# EAGLE design 25k80 (EAGLE 6.2)
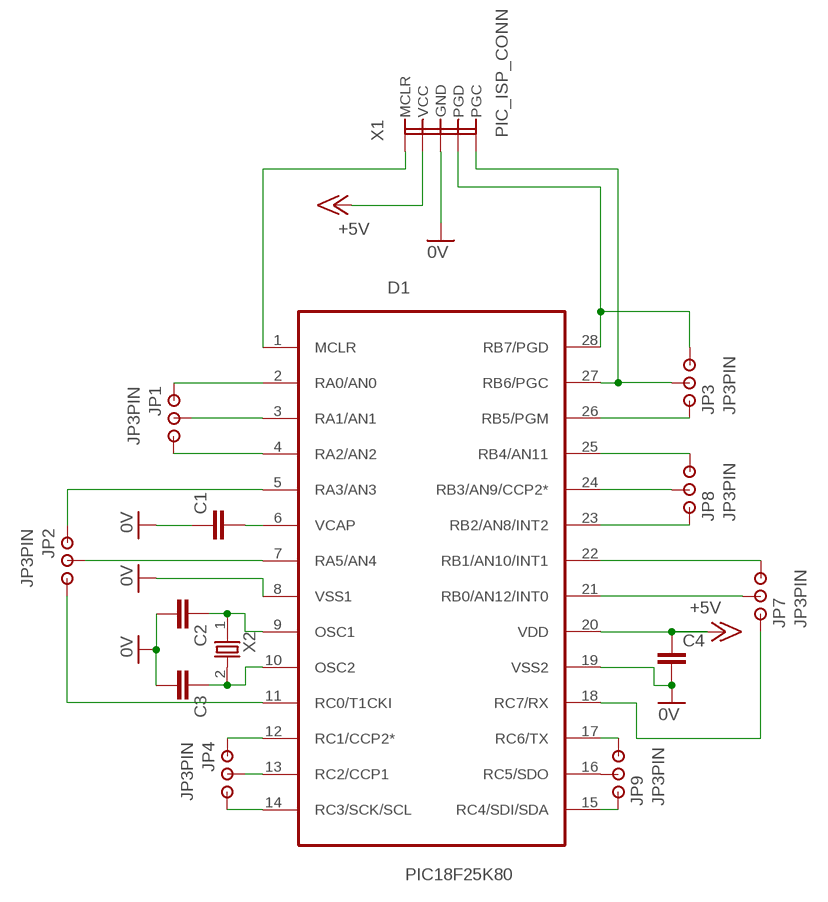
[diagram p0: schematic, sheet 1]

## Parts
C1  C0805  [C0805D]
C2  C0805  [C0805D]
C3  C0805  [C0805D]
C4  C0805  [C0805D]
D1  PIC18F25K80  [SO-28W]
JP1  JP3PIN  [PLC-3PIN]
JP2  JP3PIN  [PLC-3PIN]
JP3  JP3PIN  [PLC-3PIN]
JP4  JP3PIN  [PLC-3PIN]
JP7  JP3PIN  [PLC-3PIN]
JP8  JP3PIN  [PLC-3PIN]
JP9  JP3PIN  [PLC-3PIN]
X1  PIC_ISP_CONN  [PLC-5PIN]
X2  HC49/S  [HC49/S]

## Nets
0V: C1.1 C2.2 C3.2 C4.2 D1.8(VSS1) D1.19(VSS2) X1.P$3(GND)
+5V: C4.1 D1.20(VDD) X1.P$2(VCC)
N$1: D1.28(RB7/PGD) JP3.P$3 X1.P$4(PGD)
N$2: D1.27(RB6/PGC) JP3.P$2 X1.P$5(PGC)
N$3: D1.1(MCLR) X1.P$1(MCLR)
N$4: C1.2 D1.6(VCAP)
N$5: D1.2(RA0/AN0) JP1.P$1
N$6: D1.3(RA1/AN1) JP1.P$2
N$7: D1.4(RA2/AN2) JP1.P$3
N$8: D1.5(RA3/AN3) JP2.P$1
N$9: D1.7(RA5/AN4) JP2.P$2
N$10: D1.25(RB4/AN11) JP8.P$3
N$11: D1.26(RB5/PGM) JP3.P$1
N$12: C2.1 D1.9(OSC1) X2.1
N$13: C3.1 D1.10(OSC2) X2.2
N$14: D1.24(RB3/AN9/CCP2*) JP8.P$2
N$15: D1.23(RB2/AN8/INT2) JP8.P$1
N$16: D1.22(RB1/AN10/INT1) JP7.P$3
N$17: D1.21(RB0/AN12/INT0) JP7.P$2
N$19: D1.11(RC0/T1CKI) JP2.P$3
N$20: D1.18(RC7/RX) JP7.P$1
N$21: D1.16(RC5/SDO) JP9.P$2
N$22: D1.17(RC6/TX) JP9.P$3
N$23: D1.15(RC4/SDI/SDA) JP9.P$1
N$24: D1.14(RC3/SCK/SCL) JP4.P$3
N$25: D1.13(RC2/CCP1) JP4.P$2
N$26: D1.12(RC1/CCP2*) JP4.P$1

## Library data of the parts
C1-C4 = den:C0805
D1 = Dmitry:PIC18F25K80
JP1-JP4 JP7-JP9 = den:JP3PIN
X1 = den:PIC_ISP_CONN
X2 = den:HC49/S

## Board
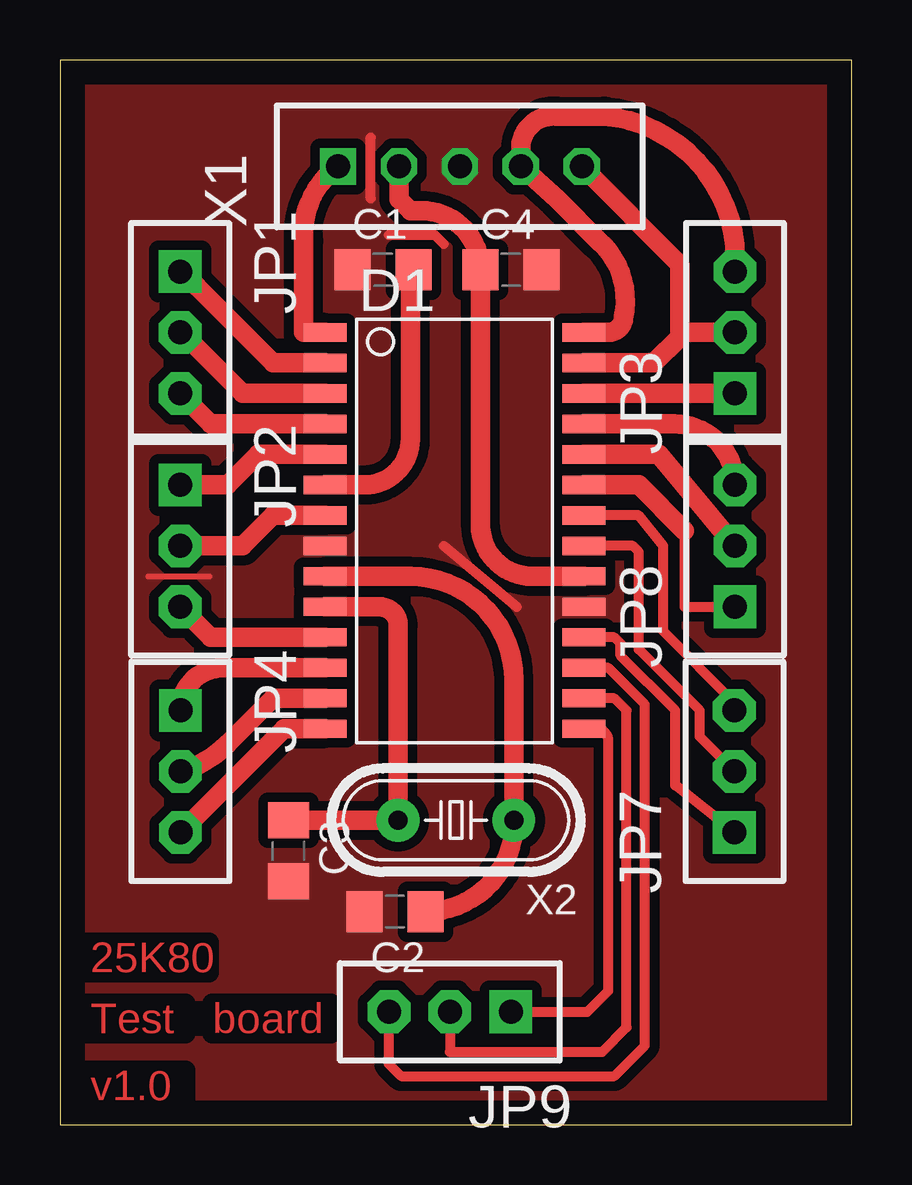
[diagram p1: board, top side]

Size 33 x 44.37 mm. Coordinates in mm from the lower left corner, seen from the top.
Outline: 0,0 33,0 33,44.37 0,44.37 0,0
Copper layers (1*16): Top 0.035mm / dielectric 1.5mm / Bottom 0.035mm
Design rules: minimum track width 10mil, minimum drill 24mil, track to track 8mil, track to pad 8mil, pad to pad 8mil, via to via 8mil, smd to smd 8mil, copper to edge 40mil, drill to drill 8mil, minimum pad ring 10mil, minimum via ring 8mil, stop-mask expansion 4mil, vias tented up to drill 0mil, thermal gap 10mil

### Footprints (pad centres in the part's own frame; a part is rotated, then mirrored left to right if it is on the bottom)
C0805D = smd 1.5 x 1.7: 1 -1.27,0; 2 1.27,0
SO-28W = smd 0.762 x 1.778: 1 -7.62,-5.461; 2 -6.35,-5.461; 3 -5.08,-5.461; 4 -3.81,-5.461; 5 -2.54,-5.461; 6 -1.27,-5.461; 7 0,-5.461; 8 1.27,-5.461; 9 2.54,-5.461; 10 3.81,-5.461; 11 5.08,-5.461; 12 6.35,-5.461; 13 7.62,-5.461; 14 8.89,-5.461; 15 8.89,5.334; 16 7.62,5.334; 17 6.35,5.334; 18 5.08,5.334; 19 3.81,5.334; 20 2.54,5.334; 21 1.27,5.334; 22 0,5.334; 23 -1.27,5.334; 24 -2.54,5.334; 25 -3.81,5.334; 26 -5.08,5.334; 27 -6.35,5.334; 28 -7.62,5.334
PLC-3PIN = drill 1 pad 1.778 square: P$1 0,0 | drill 1 pad 1.778 octagon: P$2 2.54,0; P$3 5.08,0
PLC-5PIN = drill 1 square: P$1 0,5.08 | drill 1 octagon: P$2 0,2.54; P$3 0,0; P$4 0,-2.54; P$5 0,-5.08
HC49/S = drill 0.8 pad 1.778: 1 -2.413,0; 2 2.413,0

### Placement (x,y rotation side)
C1  13.46,35.64 0 top
C2  13.97,8.89 180 top
C3  9.53,11.43 270 top
C4  18.8,35.64 0 top
D1  16.51,25.4 270 top
JP1  5.01,35.56 270 top
JP2  5.01,26.67 270 top
JP3  28.14,30.48 90 top
JP4  5.02,17.27 270 top
JP7  28.12,12.19 90 top
JP8  28.14,21.59 90 top
JP9  18.8,4.71 180 top
X1  16.67,39.94 90 top
X2  16.51,12.7 180 top

### Tracks (layer width: path | path; a pad name or v marks a point on that pad's centre or on a via)
0V
  Top 0.254: 3.68,22.86 6.22,22.86
  Top 0.406: 12.95,38.61 12.95,41.15 | 16,24.13 19.05,21.59 | 16,36.7 15.62,37.08 13.72,37.08
  pour Top (isolate 0.406, no thermals): 0,44.45 33.02,44.45 33.02,0 0,0
+5V
  Top 0.813: D1.20 19.68,22.86 arc-90 17.53,25.02 C4.1 arc90 15.06,38.1 14.61,38.1 14.13,38.57 X1.P$2
N$1
  Top 0.813: D1.28 22.86,33.02 arc90 23.5,33.66 arc59 22.48,36.83 20.73,38.57 X1.P$4 19.21,40.8 arc-90 20.7,42.04 22.68,42.04 arc-90 JP3.P$3
N$2
  Top 0.813: JP3.P$2 26.04,33.02 25.84,32.83 | 25.84,32.83 24.77,31.75 D1.27 | X1.P$5 25.84,35.85 25.84,32.83
N$3
  Top 0.813: D1.1 10.16,33.02 10.16,36.83 arc-59 X1.P$1
N$4
  Top 0.813: D1.6 12.7,26.67 arc90 14.61,28.57 14.61,35.51 arc-90 C1.2
N$5
  Top 0.813: D1.2 8.89,31.75 5.71,34.92 JP1.P$1
N$6
  Top 0.813: D1.3 7.62,30.48 5.08,33.02 JP1.P$2
N$7
  Top 0.813: D1.4 6.28,29.21 JP1.P$3
N$8
  Top 0.813: D1.5 8.26,27.94 6.99,26.67 JP2.P$1
N$9
  Top 0.813: D1.7 8.89,25.4 7.62,24.13 JP2.P$2
N$10
  Top 0.813: D1.25 25.6,29.21 arc-90 JP8.P$3
N$11
  Top 0.813: D1.26 JP3.P$1
N$12
  Top 0.813: D1.9 14.61,22.86 arc-90 18.92,18.54 X2.1 18.92,12.57 arc-90 C2.1
N$13
  Top 0.813: D1.10 13.34,21.59 arc-90 14.1,20.83 X2.2 C3.1
N$14
  Top 0.813: JP8.P$2 24.97,27.94 D1.24
N$15
  Top 0.406: JP8.P$1 26.04,21.59 26.04,24.77
  Top 0.813: 26.04,24.77 24.13,26.67 D1.23
N$16
  Top 0.406: D1.22 24.13,25.4 25.15,24.13 25.15,20.57 28.12,17.6 JP7.P$3
N$17
  Top 0.406: D1.21 23.88,24.13 24.13,23.88 24.13,19.81 26.67,17.27 26.67,16.18 JP7.P$2
N$19
  Top 0.813: D1.11 6.28,20.32 JP2.P$3
N$20
  Top 0.406: D1.18 23.11,20.32 23.37,20.07 23.37,19.56 25.65,17.27 25.65,14.15 JP7.P$1
N$21
  Top 0.406: D1.16 23.11,17.78 23.62,17.27 23.62,4.06 22.61,3.05 16.26,3.05 JP9.P$2
N$22
  Top 0.406: D1.17 22.86,19.05 24.38,17.53 24.38,3.3 23.11,2.03 14.22,2.03 13.72,2.54 JP9.P$3
N$23
  Top 0.406: JP9.P$1 21.99,4.71 22.86,5.59 22.86,16 arc90 22.35,16.51 D1.15
N$24
  Top 0.813: JP4.P$3 9.34,16.51 D1.14
N$25
  Top 0.813: D1.13 8.89,17.78 6.99,15.88 arc-30 JP4.P$2
N$26
  Top 0.813: D1.12 6.8,19.05 arc90 JP4.P$1

### Text on the board
Top: 25K80 | Test | board | v1.0